# EAGLE design AD8428 (EAGLE 7.2.0)
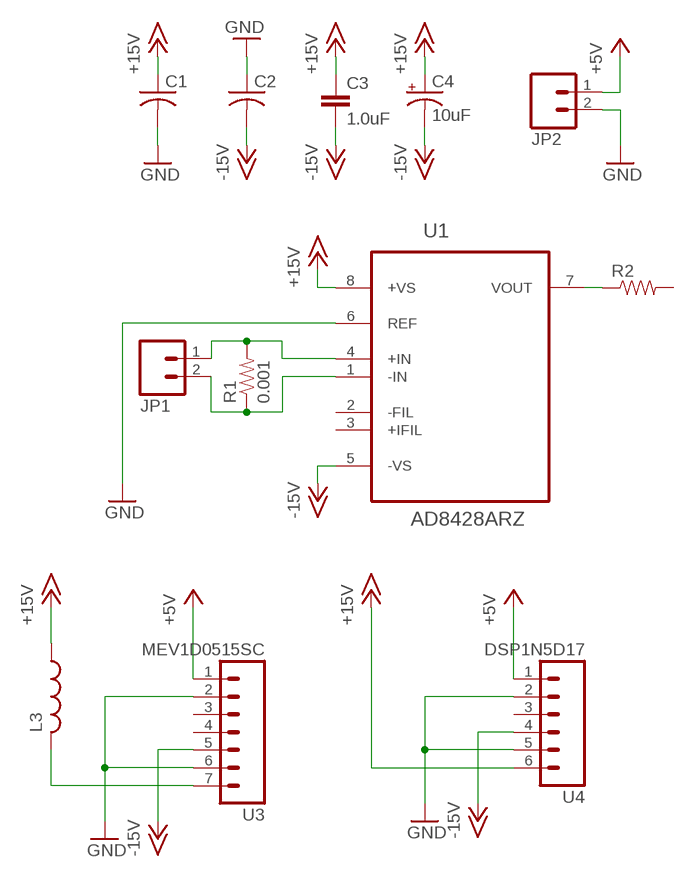
[diagram p0: schematic, sheet 1]

## Parts
C1  C-USC0603  [C0603]
C2  C-USC0603  [C0603]
C3  1.0uF  1.0UF50V10%(1206)  [1206]
C4  10uF  CAP_POL1206  [EIA3216]
JP1  M025MM  [SCREWTERMINAL-5MM-2]
JP2  M025MM  [SCREWTERMINAL-5MM-2]
L3  L-USL2825P  [L2825P]
R1  0.001  0.001OHM-3W-1%(2512)3W/1%  [2512]
R2  RESISTOR0805-RES  [0805]
U1  AD8428ARZ  [SOIC127P600X175-8N]
U3  MEV1D0515SC  M07  [1X07]
U4  DSP1N5D17  M06SILK_FEMALE_PTH  [1X06]

## Nets
+5V: JP2.1 U3.1 U4.1
+15V: C1.1 C3.1 C4.A(+) L3.1 U1.8(+VS) U4.6
+IN: JP1.1 R1.2 U1.4(+IN)
-15V: C2.2 C3.2 C4.C(-) U1.5(-VS) U3.5 U4.4
-IN: JP1.2 R1.1 U1.1(-IN)
GND: C1.2 C2.1 JP2.2 U1.6(REF) U3.2 U3.6 U4.2 U4.5
L3: L3.2 U3.7
VOUT: R2.1 U1.7(VOUT)
Unconnected: R2.2 U1.2(-FIL) U1.3(+IFIL) U3.3 U3.4 U4.3

## Library data of the parts
C1 C2 = rcl:C-US: CAPACITOR, American symbol
C3 = SparkFun-Capacitors:1.0UF50V10%(1206): CAP-09822; PROD_ID: CAP-09822
C4 = SparkFun-Capacitors:CAP_POL: Capacitor Polarized These are standard SMD and PTH capacitors. Normally 10uF, 47uF, and 100uF in electrolytic and tantalum varieties. Always verify the external diameter of the through hole cap, it varies with capacity, voltage, and manufacturer. The EIA devices should be standard.
JP1 JP2 = SparkFun-Connectors:M02: Standard 2-pin 0.1" header. Use with - straight break away headers ( PRT-00116) - right angle break away headers (PRT-00553) - swiss pins (PRT-00743) - machine pins (PRT-00117) - female headers (PRT-00115) Molex polarized connector foot print use with: PRT-08233 with associated crimp pins and housings. 2.54_SCREWTERM for use with PRT-10571. 3.5mm Screw Terminal footprints for PRT-08084 5mm Screw Terminal footprints for use with PRT-08432; STOREFRONT_ID: PRT-08432
L3 = rcl:L-US: INDUCTOR, American symbol
R1 = SparkFun-Resistors:0.001OHM-3W-1%(2512); PROD_ID: RES-12449
R2 = SparkFun-Resistors:RESISTOR: Resistor Basic schematic elements and footprints for 0603, 1206, and PTH resistors.
U1 = ADI-Phase-2:AD8428ARZ: Instrumentation Amplifier; MPN: AD8428ARZ; OC_FARNELL: 2065944; OC_NEWARK: 67T0293; PACKAGE: SOIC-8; SUPPLIER: Analog Devices
U3 = SparkFun-Connectors:M07: Header 7 Standard 7-pin 0.1" header. Use with straight break away headers (SKU : PRT-00116), right angle break away headers (PRT-00553), swiss pins (PRT-00743), machine pins (PRT-00117), and female headers (PRT-00115). NOTES ON THE VARIANTS LOCK and LOCK_LONGPADS... This footprint was designed to help hold the alignment of a through-hole component (i.e. 7-pin header) while soldering it into place. You may notice that each hole has been shifted either up or down by 0.005 of an inch from it's more standard position (which is usually a perfectly straight line). This slight alteration caused the pins (the squares in the middle) to touch the edges of the holes. Because they are alternating, it causes a "brace" to hold the header in place. 0.005 has proven to be the perfect amount of "off-center" position when using our standard breakaway headers. Although looks a little odd when you look at the bare footprint, once you have a header in there, the alteration is very hard to notice. Also, if you push a header all the way into place, it is covered up entirely on the bottom side. This idea of altering the position of holes to aid alignment will be further integrated into the Sparkfun Library for other footprints. It can help hold any component with 3 or more connection pins.
U4 = SparkFun-Connectors:M06: Header 6 Standard 6-pin 0.1" header. Use with straight break away headers (SKU : PRT-00116), right angle break away headers (PRT-00553), swiss pins (PRT-00743), machine pins (PRT-00117), and female headers (PRT-00115). Molex polarized connector foot print use with SKU : PRT-08094 with associated crimp pins and housings. NOTES ON THE VARIANTS LOCK and LOCK_LONGPADS... This footprint was designed to help hold the alignment of a through-hole component (i.e. 6-pin header) while soldering it into place. You may notice that each hole has been shifted either up or down by 0.005 of an inch from it's more standard position (which is a perfectly straight line). This slight alteration caused the pins (the squares in the middle) to touch the edges of the holes. Because they are alternating, it causes a "brace" to hold the component in place. 0.005 has proven to be the perfect amount of "off-center" position when using our standard breakaway headers. Although looks a little odd when you look at the bare footprint, once you have a header in there, the alteration is very hard to notice. Also,if you push a header all the way into place, it is covered up entirely on the bottom side. This idea of altering the position of holes to aid alignment will be further integrated into the Sparkfun Library for other footprints. It can help hold any component with 3 or more connection pins.; PROD_ID: CONN-08437

## Board
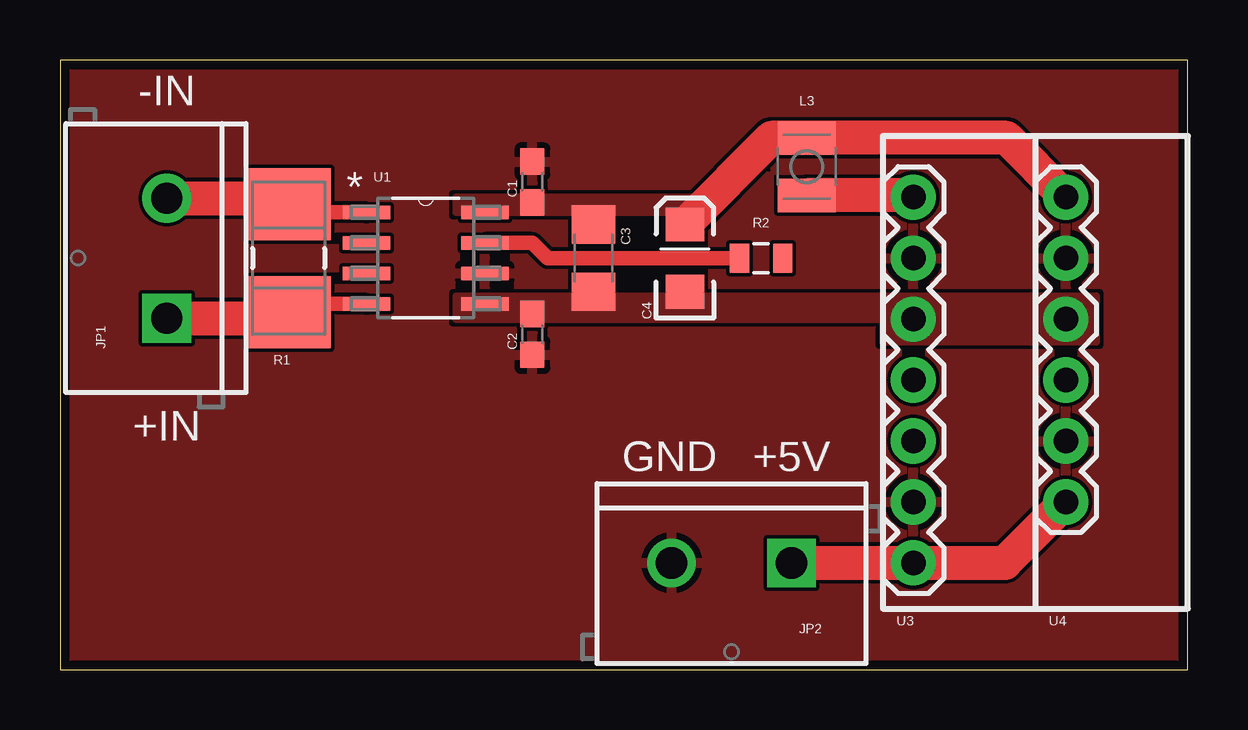
[diagram p1: board, top side]

Size 46.99 x 25.4 mm. Coordinates in mm from the lower left corner, seen from the top.
Outline: 0,0 46.99,0 46.99,25.4 0,25.4 0,0
Copper layers (1*16): Top 0.0356mm / dielectric 1.5011mm / Bottom 0.0356mm
Design rules "oshpark-2layer": minimum track width 6mil, minimum drill 13mil, track to track 6mil, track to pad 6mil, pad to pad 6mil, via to via 6mil, smd to smd 6mil, copper to edge 15mil, drill to drill 6mil, minimum pad ring 7mil, minimum via ring 7mil, stop-mask expansion 4mil, vias tented up to drill 0mil, thermal gap 10mil

### Footprints (pad centres in the part's own frame; a part is rotated, then mirrored left to right if it is on the bottom)
C0603 = smd 1.1 x 1: 1 -0.85,0; 2 0.85,0
1206 = smd 1.6 x 1.8: 1 -1.4,0; 2 1.4,0
EIA3216 = smd 1.4 x 1.6: A 1.4,0; C -1.4,0
SCREWTERMINAL-5MM-2 = drill 1.3 pad 2.032 square: 1 0,0 | drill 1.3 pad 2.032: 2 5,0
L2825P = smd 1.4 x 2.4: 1 -1.2,0; 2 1.2,0
2512 = smd 3 x 3.5: 1 -2.25,0; 2 2.25,0
0805 = smd 0.8 x 1.2: 1 -0.9,0; 2 0.9,0
SOIC127P600X175-8N = smd 1.981 x 0.559: 1 -2.464,1.905; 2 -2.464,0.635; 3 -2.464,-0.635; 4 -2.464,-1.905; 5 2.464,-1.905; 6 2.464,-0.635; 7 2.464,0.635; 8 2.464,1.905
1X07 = drill 1.016 pad 1.88: 1 0,0; 2 2.54,0; 3 5.08,0; 4 7.62,0; 5 10.16,0; 6 12.7,0; 7 15.24,0
1X06 = drill 1.016 pad 1.88: 1 0,0; 2 2.54,0; 3 5.08,0; 4 7.62,0; 5 10.16,0; 6 12.7,0

### Placement (x,y rotation side)
C1  19.68,20.32 90 top
C2  19.68,13.97 90 top
C3  22.23,17.14 270 top
C4  26.04,17.14 90 top
JP1  4.45,14.64 90 top
JP2  30.48,4.45 180 top
L3  31.11,20.95 270 top
R1  9.53,17.14 270 top
R2  29.21,17.14 0 top
U1  15.24,17.14 0 top
U3  35.56,4.45 90 top
U4  41.91,6.99 90 top

### Tracks (layer width: path | path; a pad name or v marks a point on that pad's centre or on a via)
+5V
  Top 1.422: U4.1 39.37,4.45 U3.1 JP2.1
+15V
  Top 1.422: U4.6 39.44,22.16 L3.1 29.64,22.16 C4.A
  pour Top (no thermals): 16.51,19.05 26.67,19.05 26.67,19.68 16.51,19.68
+IN
  Top 0.61: U1.4 9.95,15.24 R1.2
  Top 1.422: JP1.1 9.28,14.64 R1.2
-15V
  pour Top (no thermals): 16.51,14.61 34.29,14.61 34.29,13.65 43.18,13.65 43.18,15.56 16.51,15.56
-IN
  Top 0.61: U1.1 9.95,19.05 R1.1
  Top 1.422: JP1.2 9.28,19.64 R1.1
GND
  pour Top (rank 2): 0,0 46.99,0 46.99,25.4 0,25.4
L3
  Top 1.422: U3.7 35.49,19.75 L3.2
VOUT
  Top 0.61: R2.1 20.32,17.14 19.68,17.78 U1.7

### Text on the board
tPlace: -IN | +IN | GND | +5V